# EAGLE schematic Tablero_Potencia (para PDF) (EAGLE 9.6.2)
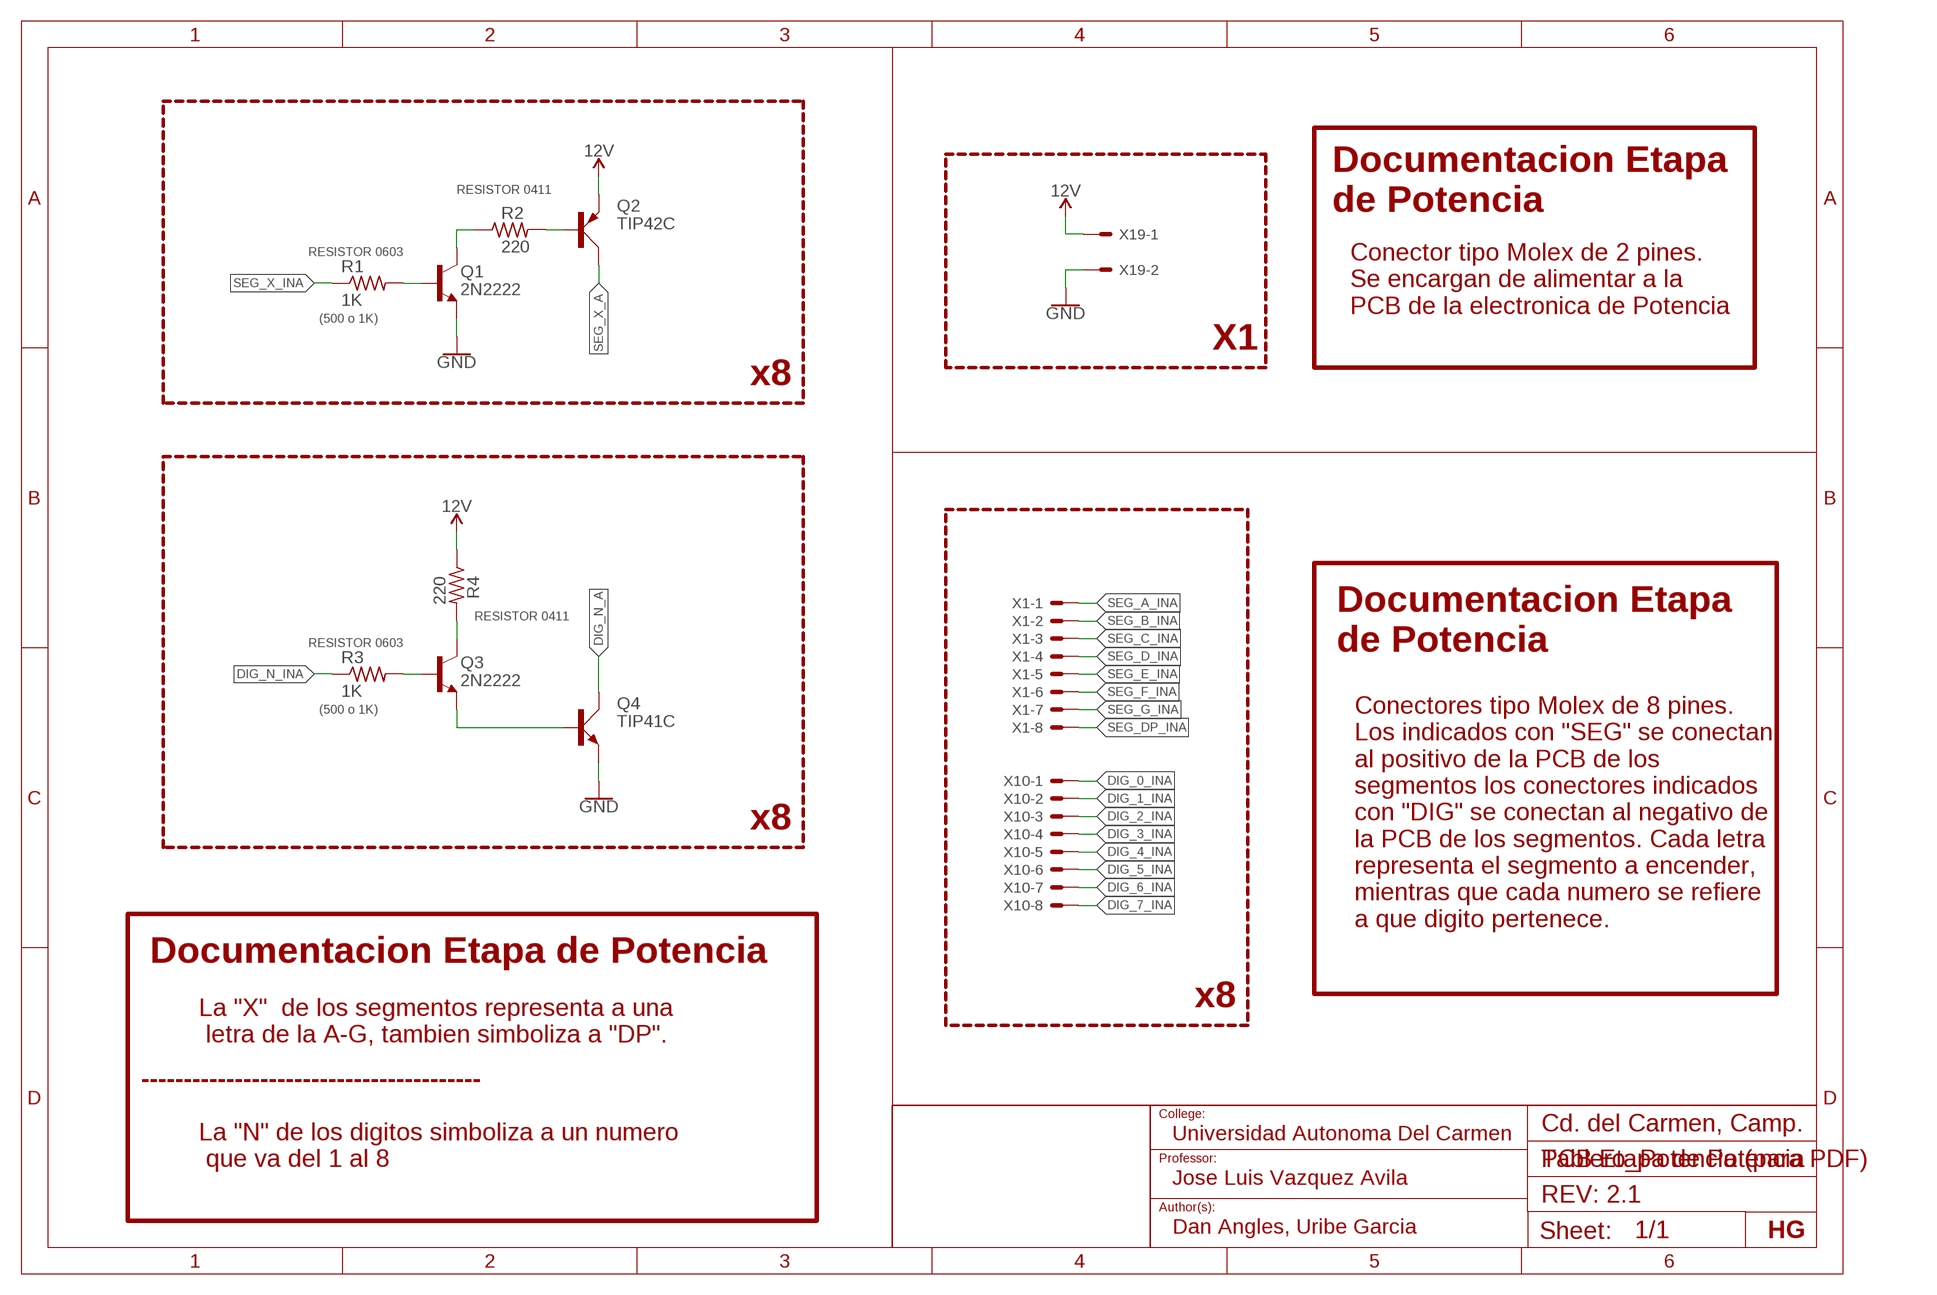
[diagram p0: schematic, sheet 1]

## Parts
Q1  2N2222  BJT-NPNTO92  [TO92]
Q2  TIP42C  [TO220AV]
Q3  2N2222  BJT-NPNTO92  [TO92]
Q4  TIP41C  [TO220AV]
R1  1K  R-US_R0603  [R0603]
R2  220  R-US_0411/15  [0411/15]
R3  1K  R-US_R0603  [R0603]
R4  220  R-US_0411/15  [0411/15]
X1  KK-156-8  [KK-156-8]
X10  KK-156-8  [KK-156-8]
X19  KK-156-2  [KK-156-2]

## Nets
DIG_0_INA: X10.1
DIG_1_INA: X10.2
DIG_2_INA: X10.3
DIG_3_INA: X10.4
DIG_4_INA: X10.5
DIG_5_INA: X10.6
DIG_6_INA: X10.7
DIG_7_INA: X10.8
DIG_N_A [12V]: Q4.C
DIG_N_INA: R3.1
GND: Q1.3(E) Q4.E X19.2
N$1: Q2.B R2.2
N$2: Q1.1(C) R2.1
N$3: Q3.1(C) R4.2
N$4: Q3.3(E) Q4.B
N$11: Q3.2(B) R3.2
N$12: Q1.2(B) R1.2
SEG_A_INA: X1.1
SEG_B_INA: X1.2
SEG_C_INA: X1.3
SEG_D_INA: X1.4
SEG_DP_INA: X1.8
SEG_E_INA: X1.5
SEG_F_INA: X1.6
SEG_G_INA: X1.7
SEG_X_A [12V]: Q2.C
SEG_X_INA: R1.1
VCC [12VV]: Q2.E R4.1 X19.1 ; supply symbol labelled 12V

## Notes on the sheet
- RESISTOR 0411
- Documentacion Etapa
  de Potencia
- RESISTOR 0603
- Conector tipo Molex de 2 pines.
  Se encargan de alimentar a la
  PCB de la electronica de Potencia
- (500 o 1K)
- X1
- x8
- RESISTOR 0411
- RESISTOR 0603
- Documentacion Etapa
  de Potencia
- (500 o 1K)
- x8
- Conectores tipo Molex de 8 pines.
  Los indicados con "SEG" se conectan
  al positivo de la PCB de los 
  segmentos los conectores indicados 
  con "DIG" se conectan al negativo de
  la PCB de los segmentos. Cada letra
  representa el segmento a encender,
  mientras que cada numero se refiere
  a que digito pertenece.
- Documentacion Etapa de Potencia
- x8
- La "X"  de los segmentos representa a una
   letra de la A-G, tambien simboliza a "DP".
- ----------------------------------------
- College:
- Cd. del Carmen, Camp.
- Universidad Autonoma Del Carmen
- Professor:
- La "N" de los digitos simboliza a un numero
   que va del 1 al 8
- PCB Etapa de Potencia
- Jose Luis Vazquez Avila
- REV: 2.1
- Author(s):
- Dan Angles, Uribe Garcia | HG

## Library data of the parts
Q1 Q3 = bt_transistor:BJT-NPN: NPN Transistor Small signal NPN Bipolar Junction Transistor (BJT). Use this device to represent any of a number of such transistors with similar package and pinout: 2N4401, 2N3904, 2N2222, etc.
Q2 = transistor-power:TIP42C: PNP TRANSISTOR
Q4 = transistor-power:TIP41C: NPN TRANSISTOR
R1-R4 = rcl:R-US_: RESISTOR, American symbol; SPICEPREFIX: R
X1 X10 = con-molex:KK-156-8: KK 156 HEADER Source: http://www.molex.com/pdm_docs/sd/026604100_sd.pdf; MF: MOLEX; OC_FARNELL: unknown; OC_NEWARK: unknown
X19 = con-molex:KK-156-2: KK 156 HEADER Source: http://www.molex.com/pdm_docs/sd/026604100_sd.pdf; MF: MOLEX; OC_FARNELL: unknown; OC_NEWARK: unknown

## Net classes
0 default: width 0.3 mm, clearance 0.205 mm
1 12V: width 0.7 mm, clearance 0.5 mm
2 12VV: width 1 mm, clearance 0.45 mm